# Altium schematic sheet [1]-Block Diagram.SchDoc
size A4; SheetNumber: 1; SheetTotal: 2
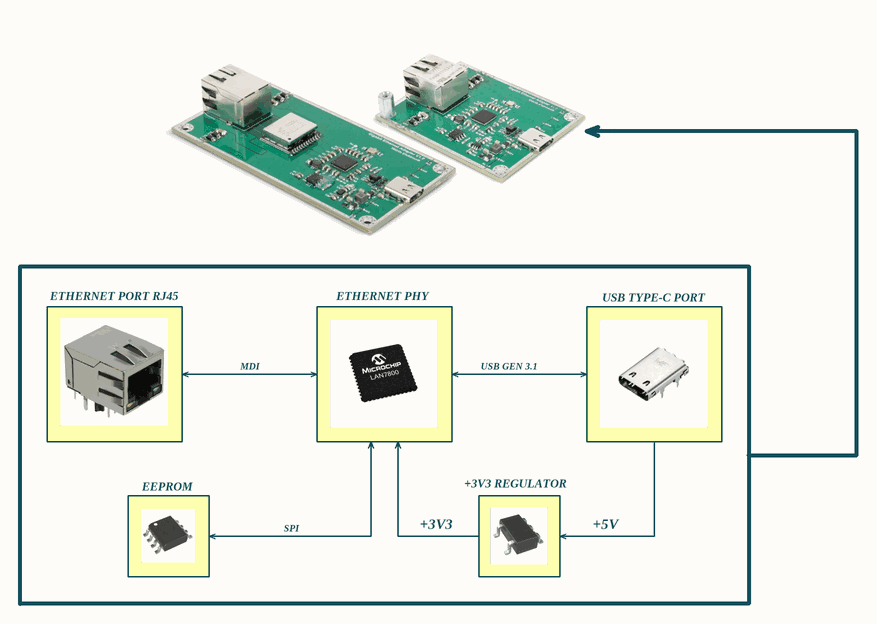
[diagram p0: [1]-Block Diagram.SchDoc]

## Notes on the sheet
- ETHERNET PORT RJ45
- ETHERNET PHY
- USB TYPE-C PORT
- MDI
- USB GEN 3.1
- EEPROM
- SPI
- +3V3
- +3V3 REGULATOR
- +5V